# EAGLE design Juki_AD (EAGLE 5.11)

## Sheet 1 of 5
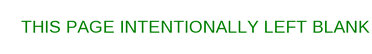
[diagram p0: schematic, sheet 1]

### Notes on the sheet
- THIS PAGE INTENTIONALLY LEFT BLANK

## Sheet 2 of 5
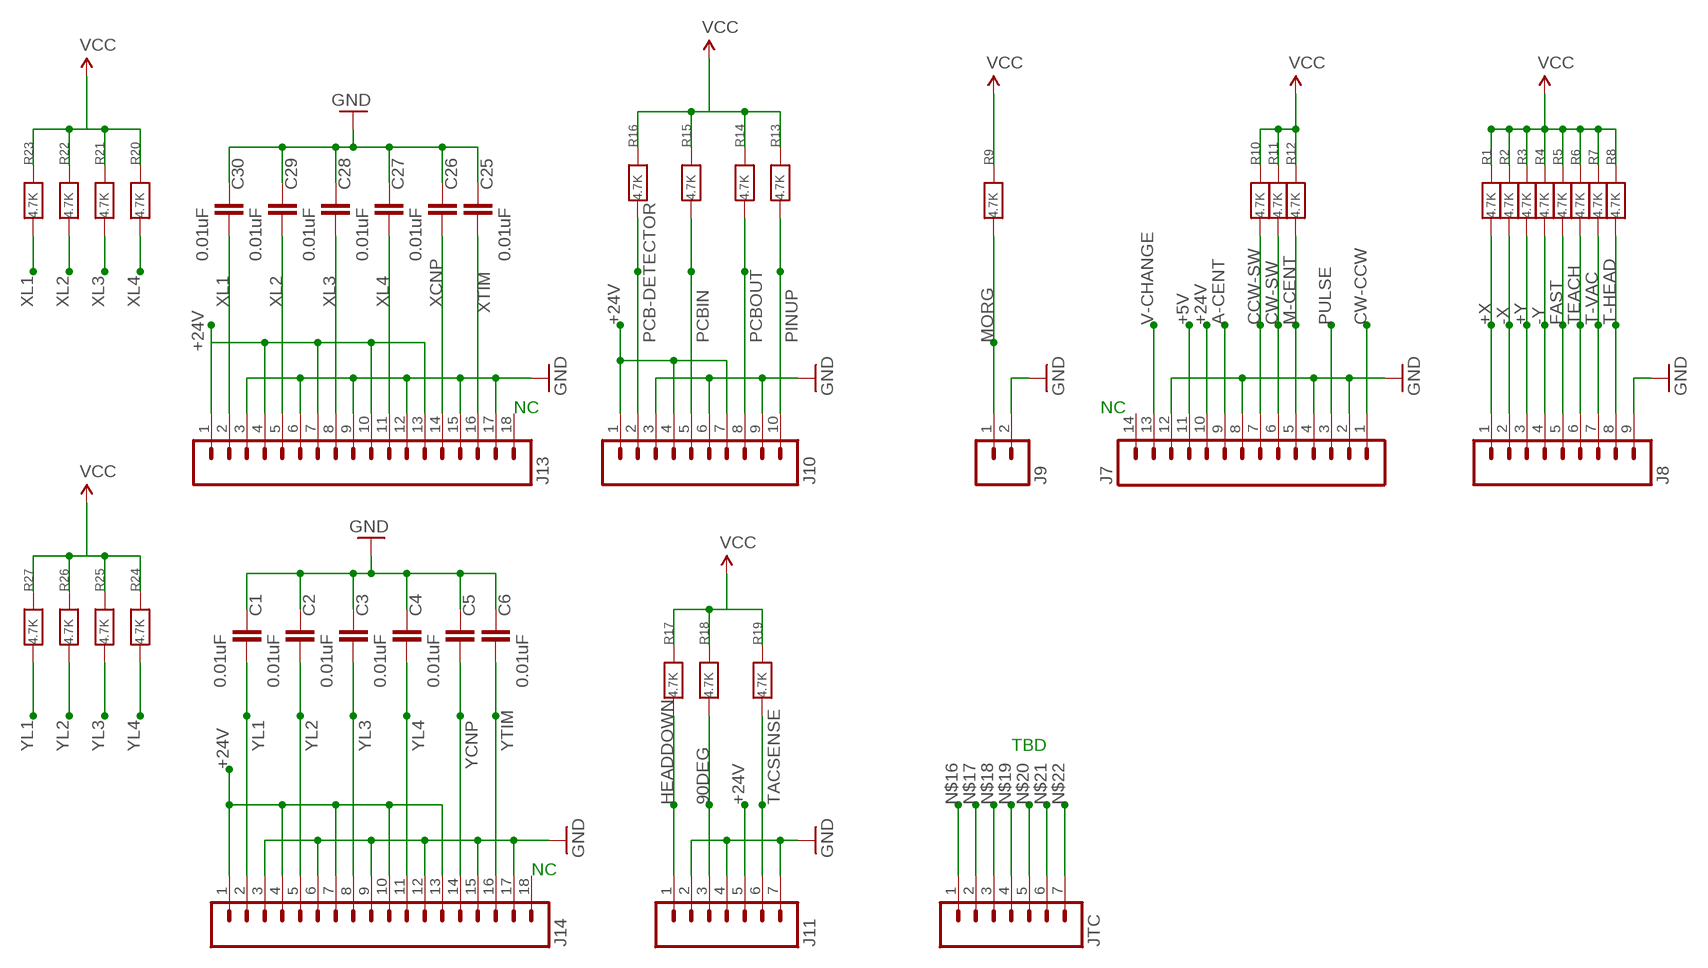
[diagram p1: schematic, sheet 2]

### Parts
C1  0.01uF  CAP0805  [0805]
C2  0.01uF  CAP0805  [0805]
C3  0.01uF  CAP0805  [0805]
C4  0.01uF  CAP0805  [0805]
C5  0.01uF  CAP0805  [0805]
C6  0.01uF  CAP0805  [0805]
C25  0.01uF  CAP0805  [0805]
C26  0.01uF  CAP0805  [0805]
C27  0.01uF  CAP0805  [0805]
C28  0.01uF  CAP0805  [0805]
C29  0.01uF  CAP0805  [0805]
C30  0.01uF  CAP0805  [0805]
J7  M14  [14P]
J8  M09  [09P]
J9  M02  [02P]
J10  M10  [10P]
J11  M07  [07P]
J13  M18  [18P]
J14  M18  [18P]
JTC  M07  [07P]
R1  4.7K  RESISTOR0805  [0805]
R2  4.7K  RESISTOR0805  [0805]
R3  4.7K  RESISTOR0805  [0805]
R4  4.7K  RESISTOR0805  [0805]
R5  4.7K  RESISTOR0805  [0805]
R6  4.7K  RESISTOR0805  [0805]
R7  4.7K  RESISTOR0805  [0805]
R8  4.7K  RESISTOR0805  [0805]
R9  4.7K  RESISTOR0805  [0805]
R10  4.7K  RESISTOR0805  [0805]
R11  4.7K  RESISTOR0805  [0805]
R12  4.7K  RESISTOR0805  [0805]
R13  4.7K  RESISTOR0805  [0805]
R14  4.7K  RESISTOR0805  [0805]
R15  4.7K  RESISTOR0805  [0805]
R16  4.7K  RESISTOR0805  [0805]
R17  4.7K  RESISTOR0805  [0805]
R18  4.7K  RESISTOR0805  [0805]
R19  4.7K  RESISTOR0805  [0805]
R20  4.7K  RESISTOR0805  [0805]
R21  4.7K  RESISTOR0805  [0805]
R22  4.7K  RESISTOR0805  [0805]
R23  4.7K  RESISTOR0805  [0805]
R24  4.7K  RESISTOR0805  [0805]
R25  4.7K  RESISTOR0805  [0805]
R26  4.7K  RESISTOR0805  [0805]
R27  4.7K  RESISTOR0805  [0805]

### Nets
90DEG: J11.3 R18.1
+5V [power]: J7.11 R1.2 R2.2 R3.2 R4.2 R5.2 R6.2 R7.2 R8.2 R9.2 R10.2 R11.2 R12.2 R13.2 R14.2 R15.2 R16.2 R17.2 R18.2 R19.2 R20.2 R21.2 R22.2 R23.2 R24.2 R25.2 R26.2 R27.2 ; supply symbol labelled VCC ; also sheet 3
+24V [power]: J7.10 J10.1 J10.4 J10.7 J11.5 J13.1 J13.4 J13.7 J13.10 J13.13 J14.1 J14.4 J14.7 J14.10 J14.13 ; also sheet 3
+X: J8.1 R1.1
+Y: J8.3 R3.1
-X: J8.2 R2.1
-Y: J8.4 R4.1
A-CENT: J7.9
CCW-SW: J7.7 R10.1
CW-CCW: J7.1
CW-SW: J7.6 R11.1
FAST: J8.5 R5.1
GND: C1.1 C2.1 C3.1 C4.1 C5.1 C6.1 C25.1 C26.1 C27.1 C28.1 C29.1 C30.1 J7.2 J7.4 J7.8 J7.12 J8.9 J9.2 J10.3 J10.6 J10.9 J11.2 J11.4 J11.7 J13.3 J13.6 J13.9 J13.12 J13.15 J13.17 J14.3 J14.6 J14.9 J14.12 J14.15 J14.17 ; also sheet 3,4,5
HEADDOWN: J11.1 R17.1
M-CENT: J7.5 R12.1
MORG: J9.1 R9.1
N$16: JTC.1
N$17: JTC.2
N$18: JTC.3
N$19: JTC.4
N$20: JTC.5
N$21: JTC.6
N$22: JTC.7
PCB-DETECTOR: J10.2 R16.1
PCBIN: J10.5 R15.1
PCBOUT: J10.8 R14.1
PINUP: J10.10 R13.1
PULSE: J7.3
T-HEAD: J8.8 R8.1
T-VAC: J8.7 R7.1
TACSENSE: J11.6 R19.1
TEACH: J8.6 R6.1
V-CHANGE: J7.13
XCNP: C26.2 J13.14
XL1: C30.2 J13.2 R23.1
XL2: C29.2 J13.5 R22.1
XL3: C28.2 J13.8 R21.1
XL4: C27.2 J13.11 R20.1
XTIM: C25.2 J13.16
YCNP: C5.2 J14.14
YL1: C1.2 J14.2 R27.1
YL2: C2.2 J14.5 R26.1
YL3: C3.2 J14.8 R25.1
YL4: C4.2 J14.11 R24.1
YTIM: C6.2 J14.16
Unconnected: J7.14 J13.18 J14.18

### Notes on the sheet
- NC | NC
- TBD
- NC

## Sheet 3 of 5
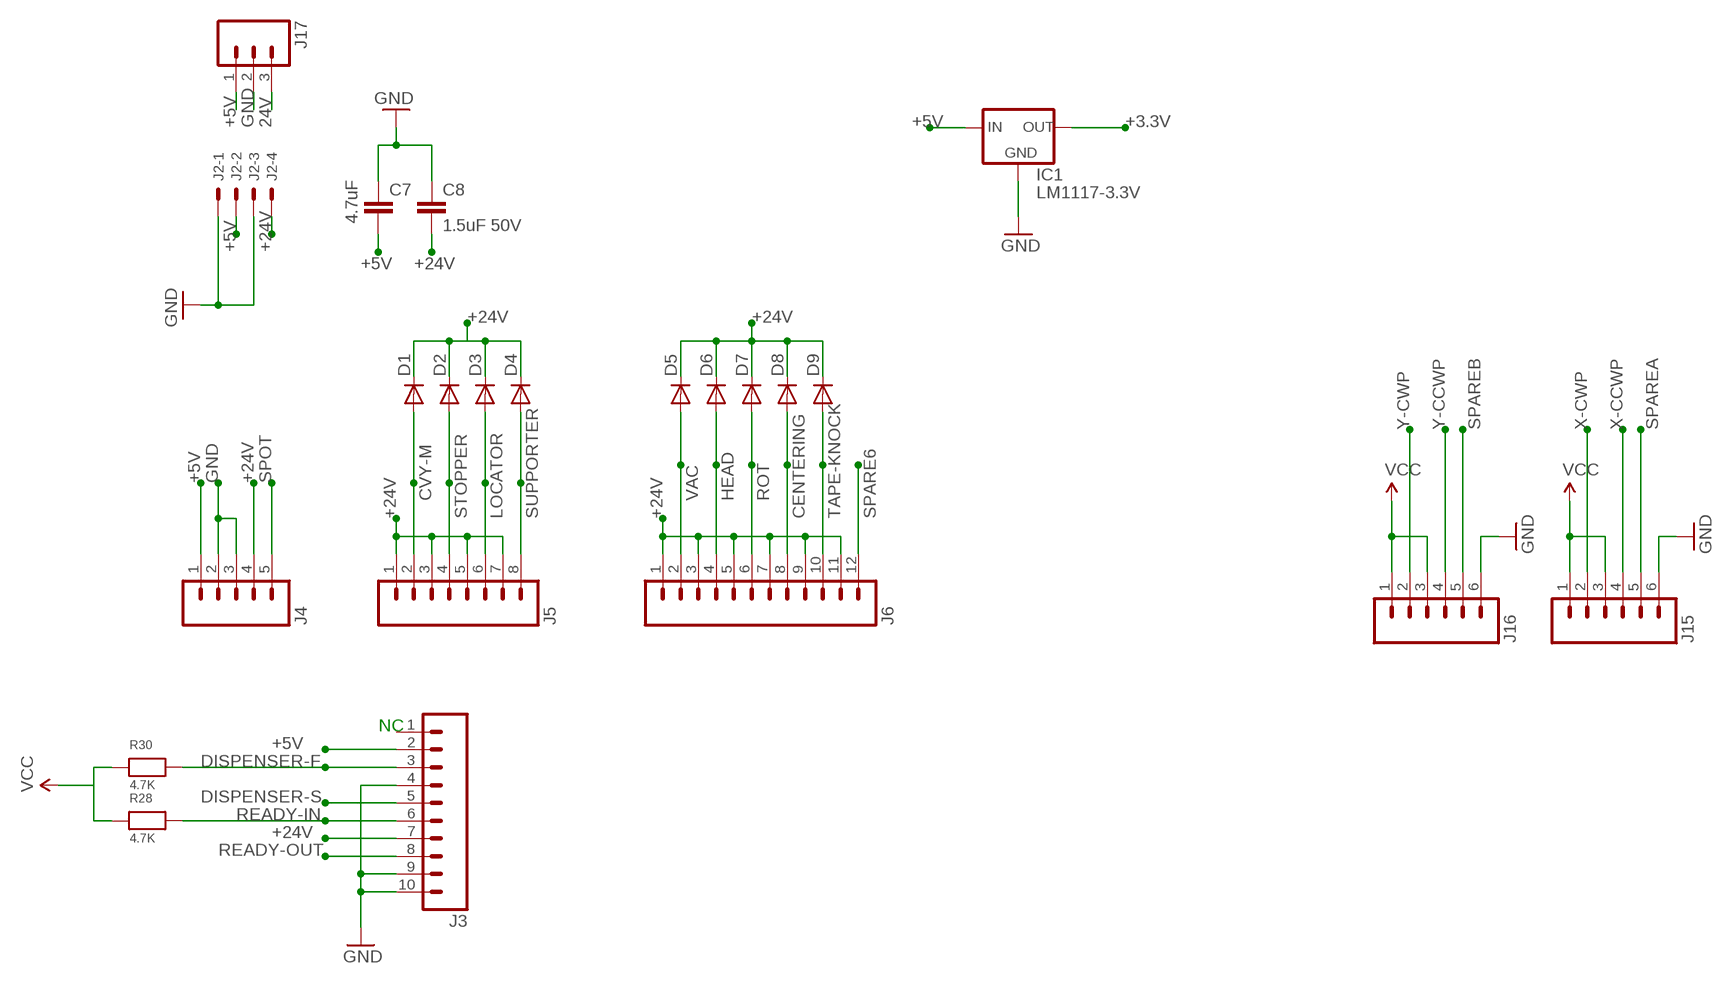
[diagram p2: schematic, sheet 3]

### Parts
C7  4.7uF  CAP0805  [0805]
C8  1.5uF 50V  CAP0805  [0805]
D1  DIODESOD  [SOD-323]
D2  DIODESOD  [SOD-323]
D3  DIODESOD  [SOD-323]
D4  DIODESOD  [SOD-323]
D5  DIODESOD  [SOD-323]
D6  DIODESOD  [SOD-323]
D7  DIODESOD  [SOD-323]
D8  DIODESOD  [SOD-323]
D9  DIODESOD  [SOD-323]
IC1  LM1117-3.3V  LM1117  [SOT223]
J2  KK-156-4  [KK-156-4]
J3  M10  [10P]
J4  M05  [05P]
J5  M08  [08P]
J6  M12  [12P]
J15  M06  [06P]
J16  M06  [06P]
J17  M03  [03P]
R28  4.7K  RESISTOR0805  [0805]
R30  4.7K  RESISTOR0805  [0805]

### Nets
24V: J17.3
+3.3V: IC1.2(OUT)
+5V [power]: C7.2 IC1.3(IN) J2.2 J3.2 J4.1 J15.1 J15.3 J16.1 J16.3 J17.1 R28.1 R30.1 ; supply symbol labelled VCC ; also sheet 2
+24V [power]: C8.2 D1.1(C) D2.1(C) D3.1(C) D4.1(C) D5.1(C) D6.1(C) D7.1(C) D8.1(C) D9.1(C) J2.4 J3.7 J4.4 J5.1 J5.3 J5.5 J5.7 J6.1 J6.3 J6.5 J6.7 J6.9 J6.11 ; also sheet 2
CENTERING: D8.2(A) J6.8 ; also sheet 5
CVY-M: D1.2(A) J5.2
DISPENSER-F: J3.3 R30.2
DISPENSER-S: J3.5
GND: C7.1 C8.1 IC1.1(GND) J2.1 J2.3 J3.4 J3.9 J3.10 J4.2 J4.3 J15.6 J16.6 J17.2 ; also sheet 2,4,5
HEAD: D6.2(A) J6.4 ; also sheet 5
LOCATOR: D3.2(A) J5.6
READY-IN: J3.6 R28.2
READY-OUT: J3.8
ROT: D7.2(A) J6.6 ; also sheet 5
SPARE6: J6.12
SPAREA: J15.5 ; also sheet 5
SPAREB: J16.5 ; also sheet 5
SPOT: J4.5
STOPPER: D2.2(A) J5.4
SUPPORTER: D4.2(A) J5.8
TAPE-KNOCK: D9.2(A) J6.10 ; also sheet 5
VAC: D5.2(A) J6.2 ; also sheet 5
X-CCWP: J15.4 ; also sheet 5
X-CWP: J15.2 ; also sheet 5
Y-CCWP: J16.4 ; also sheet 5
Y-CWP: J16.2 ; also sheet 5
Unconnected: J3.1

### Notes on the sheet
- NC

## Sheet 4 of 5
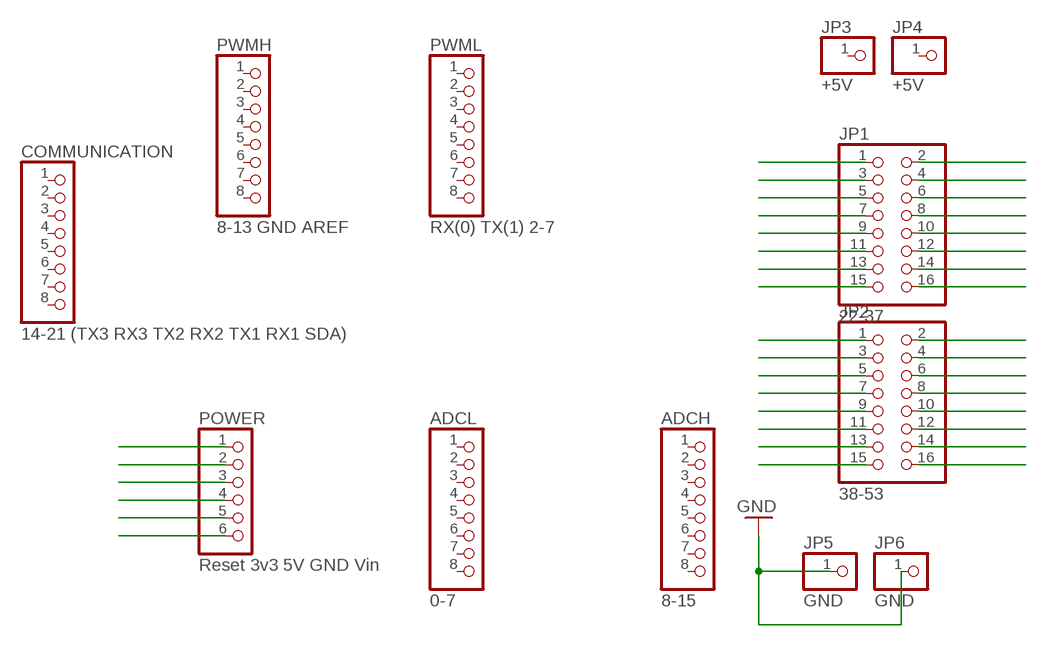
[diagram p3: schematic, sheet 4]

### Parts
ADCH  8-15  PINHD-1X8  [1X08]
ADCL  0-7  PINHD-1X8  [1X08]
COMMUNICATION  14-21 (TX3 RX3 TX2 RX2 TX1 RX1 SDA)  PINHD-1X8  [1X08]
JP1  22-37  PINHD-2X8  [2X08]
JP2  38-53  PINHD-2X8  [2X08]
JP3  +5V  PINHD-1X1  [1X01]
JP4  +5V  PINHD-1X1  [1X01]
JP5  GND  PINHD-1X1  [1X01]
JP6  GND  PINHD-1X1  [1X01]
POWER  Reset 3v3 5V GND Vin  PINHD-1X6  [1X06]
PWMH  8-13 GND AREF  PINHD-1X8  [1X08]
PWML  RX(0) TX(1) 2-7  PINHD-1X8  [1X08]

### Nets
GND: JP5.1 JP6.1 ; also sheet 2,3,5
N$5: JP1.1 JP1.2 JP1.3 JP1.4 JP1.5 JP1.6 JP1.7 JP1.8 JP1.9 JP1.10 JP1.11 JP1.12 JP1.13 JP1.14 JP1.15 JP1.16 JP2.1 JP2.2 JP2.3 JP2.4 JP2.5 JP2.6 JP2.7 JP2.8 JP2.9 JP2.10 JP2.11 JP2.12 JP2.13 JP2.14 JP2.15 JP2.16 POWER.1
N$6: POWER.2
N$7: POWER.3 POWER.4 POWER.5 POWER.6
Unconnected: ADCH.1 ADCH.2 ADCH.3 ADCH.4 ADCH.5 ADCH.6 ADCH.7 ADCH.8 ADCL.1 ADCL.2 ADCL.3 ADCL.4 ADCL.5 ADCL.6 ADCL.7 ADCL.8 COMMUNICATION.1 COMMUNICATION.2 COMMUNICATION.3 COMMUNICATION.4 COMMUNICATION.5 COMMUNICATION.6 COMMUNICATION.7 COMMUNICATION.8 JP3.1 JP4.1 PWMH.1 PWMH.2 PWMH.3 PWMH.4 PWMH.5 PWMH.6 PWMH.7 PWMH.8 PWML.1 PWML.2 PWML.3 PWML.4 PWML.5 PWML.6 PWML.7 PWML.8

## Sheet 5 of 5
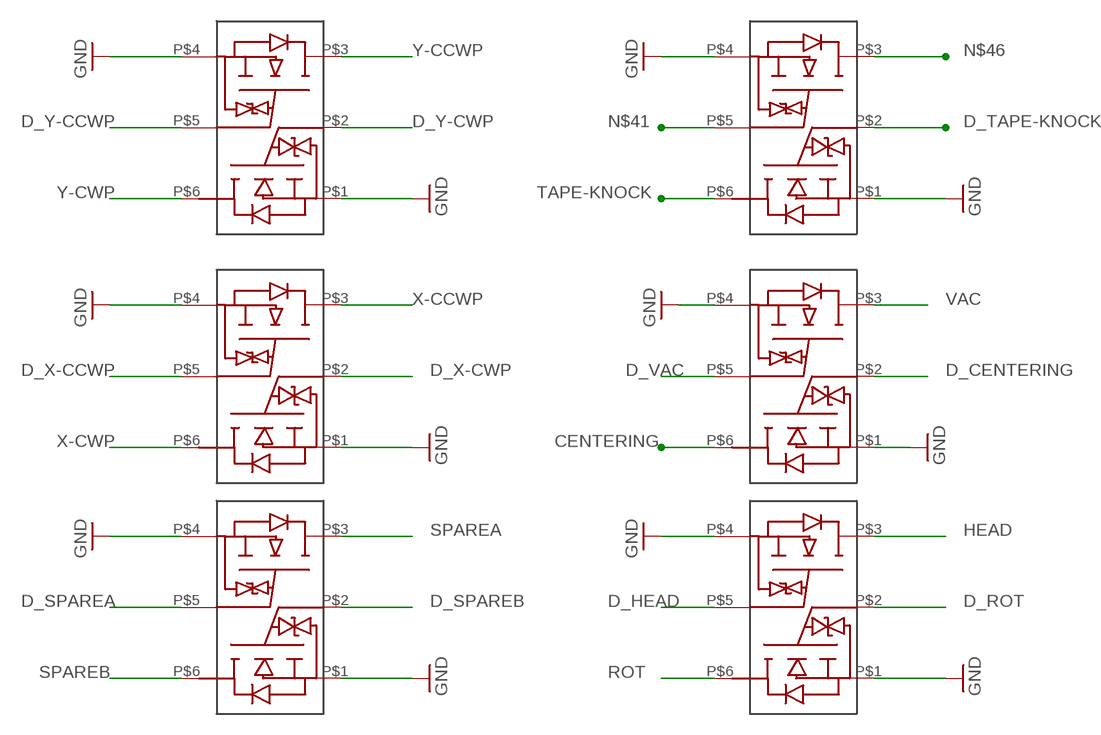
[diagram p4: schematic, sheet 5]

### Parts
U$1  US6K1TR  [TUMT6]
U$2  US6K1TR  [TUMT6]
U$3  US6K1TR  [TUMT6]
U$4  US6K1TR  [TUMT6]
U$5  US6K1TR  [TUMT6]
U$6  US6K1TR  [TUMT6]

### Nets
CENTERING: U$2.P$6 ; also sheet 3
D_CENTERING: U$2.P$2
D_HEAD: U$1.P$5
D_ROT: U$1.P$2
D_SPAREA: U$6.P$5
D_SPAREB: U$6.P$2
D_TAPE-KNOCK: U$4.P$2
D_VAC: U$2.P$5
D_X-CCWP: U$5.P$5
D_X-CWP: U$5.P$2
D_Y-CCWP: U$3.P$5
D_Y-CWP: U$3.P$2
GND: U$1.P$1 U$1.P$4 U$2.P$1 U$2.P$4 U$3.P$1 U$3.P$4 U$4.P$1 U$4.P$4 U$5.P$1 U$5.P$4 U$6.P$1 U$6.P$4 ; also sheet 2,3,4
HEAD: U$1.P$3 ; also sheet 3
N$41: U$4.P$5
N$46: U$4.P$3
ROT: U$1.P$6 ; also sheet 3
SPAREA: U$6.P$3 ; also sheet 3
SPAREB: U$6.P$6 ; also sheet 3
TAPE-KNOCK: U$4.P$6 ; also sheet 3
VAC: U$2.P$3 ; also sheet 3
X-CCWP: U$5.P$3 ; also sheet 3
X-CWP: U$5.P$6 ; also sheet 3
Y-CCWP: U$3.P$3 ; also sheet 3
Y-CWP: U$3.P$6 ; also sheet 3

## Library data of the parts
ADCH ADCL COMMUNICATION PWMH PWML = pinhead:PINHD-1X8: PIN HEADER
C1-C8 C25-C30 = SparkFun:CAP: Capacitor Standard 0603 ceramic capacitor, and 0.1" leaded capacitor.
D1-D9 = SparkFun:DIODE: Diode These are standard reverse protection diodes and small signal diodes. SMA package can handle up to about 1A. SOD-323 can handle about 200mA. What the SOD-323 package when ordering, there are some mfgs out there that are 5-pin packages.
IC1 = v-reg-3:LM1117
J2 = con-molex:KK-156-4: KK 156 HEADER Source: http://www.molex.com/pdm_docs/sd/026604100_sd.pdf; OC_FARNELL: unknown; OC_NEWARK: unknown
J3 J10 = con-amp-quick:M10: AMP QUICK CONNECTOR; OC_FARNELL: unknown; OC_NEWARK: unknown
J4 = con-amp-quick:M05: AMP QUICK CONNECTOR; OC_FARNELL: unknown; OC_NEWARK: unknown
J5 = con-amp-quick:M08: AMP QUICK CONNECTOR; OC_FARNELL: unknown; OC_NEWARK: unknown
J6 = con-amp-quick:M12: AMP QUICK CONNECTOR; OC_FARNELL: unknown; OC_NEWARK: unknown
J7 = con-amp-quick:M14: AMP QUICK CONNECTOR; OC_FARNELL: unknown; OC_NEWARK: unknown
J8 = con-amp-quick:M09: AMP QUICK CONNECTOR; OC_FARNELL: unknown; OC_NEWARK: unknown
J9 = con-amp-quick:M02: AMP QUICK CONNECTOR; OC_FARNELL: unknown; OC_NEWARK: unknown
J11 JTC = con-amp-quick:M07: AMP QUICK CONNECTOR; OC_FARNELL: unknown; OC_NEWARK: unknown
J13 J14 = con-amp-quick:M18: M18P Header
J15 J16 = con-amp-quick:M06: AMP QUICK CONNECTOR; OC_FARNELL: unknown; OC_NEWARK: unknown
J17 = con-amp-quick:M03: AMP QUICK CONNECTOR; OC_FARNELL: unknown; OC_NEWARK: unknown
JP1 JP2 = pinhead:PINHD-2X8: PIN HEADER
JP3-JP6 = pinhead:PINHD-1X1: PIN HEADER
POWER = pinhead:PINHD-1X6: PIN HEADER
R1-R28 R30 = microbuilder:RESISTOR: Resistors 0402 - 0402 Surface Mount Package 10.0K 1% 1/16W [Digikey: 311-10.0KLRTR-ND] 0603 - 0603 Surface Mount Package 0 Ohm 1/10 Watt 1% Resistor 15 Ohm 1/10 Watt 1% Resistor 33 Ohm 1/10 Watt 1% Resistor 49.9 Ohm 1/10 Watt 1% Resistor 100 Ohm 1/10 Watt 1% Resistor 150 Ohm 1/10 Watt 1% Resistor 240 Ohm 1/10 Watt 1% Resistor 390 Ohm 1/10 Watt 1% Resistor 560 Ohm 1/10 Watt 1% Resistor 750 Ohm 1/10 Watt 1% Resistor 1.0K Ohm 1/10 Watt 1% Resistor 1.5K Ohm 1/10 Watt 1% Resistor 2.0K Ohm 1/10 Watt 1% Resistor 4.7K Ohm 1/10 Watt 1% Resistor 10.0K Ohm 1/10 Watt 1% Resistor 20.0K Ohm 1/10 Watt 1% Resistor 33.0K Ohm 1/10 Watt 1% Resistor 100.0K Ohm 1/10 Watt 1% Resistor 0805 - 0805 Surface Mount Package 0 Ohm 1/8 Watt 1% Resistor 33 Ohm 1/8 Watt 1% Resistor 100 Ohm 1/8 Watt 1% Resistor 150 Ohm 1/8 Watt 1% Resistor 200 Ohm 1/8 Watt 1% Resistor 240 Ohm 1/8 Watt 1% Resistor 330 Ohm 1/8 Watt 1% Resistor 390 Ohm 1/8 Watt 1% Resistor 470 Ohm 1/8 Watt 1% Resistor 1.0K Ohm 1/8 Watt 1% Resistor 1.5K Ohm 1/8 Watt 1% Resistor 2.0K Ohm 1/8 Watt 1% Resistor 4.7K Ohm 1/8 Watt 1% Resistor 5.1K Ohm 1/8 Watt 1% Resistor 5.6K Ohm 1/8 Watt 1% Resistor 10.0K Ohm 1/8 Watt 1% Resistor 22.0K Ohm 1/8 Watt 1% Resistor 33.0K Ohm 1/8 Watt 1% Resistor 100K Ohm 1/8 Watt 1% Resistor 1206 - 1206 Surface Mount Package
U$1-U$6 = Nullspace:US6K1TR: US6K1TR MOSFET

## Net classes
0 default: width 0.254 mm
1 power: width 0.635 mm

## Board
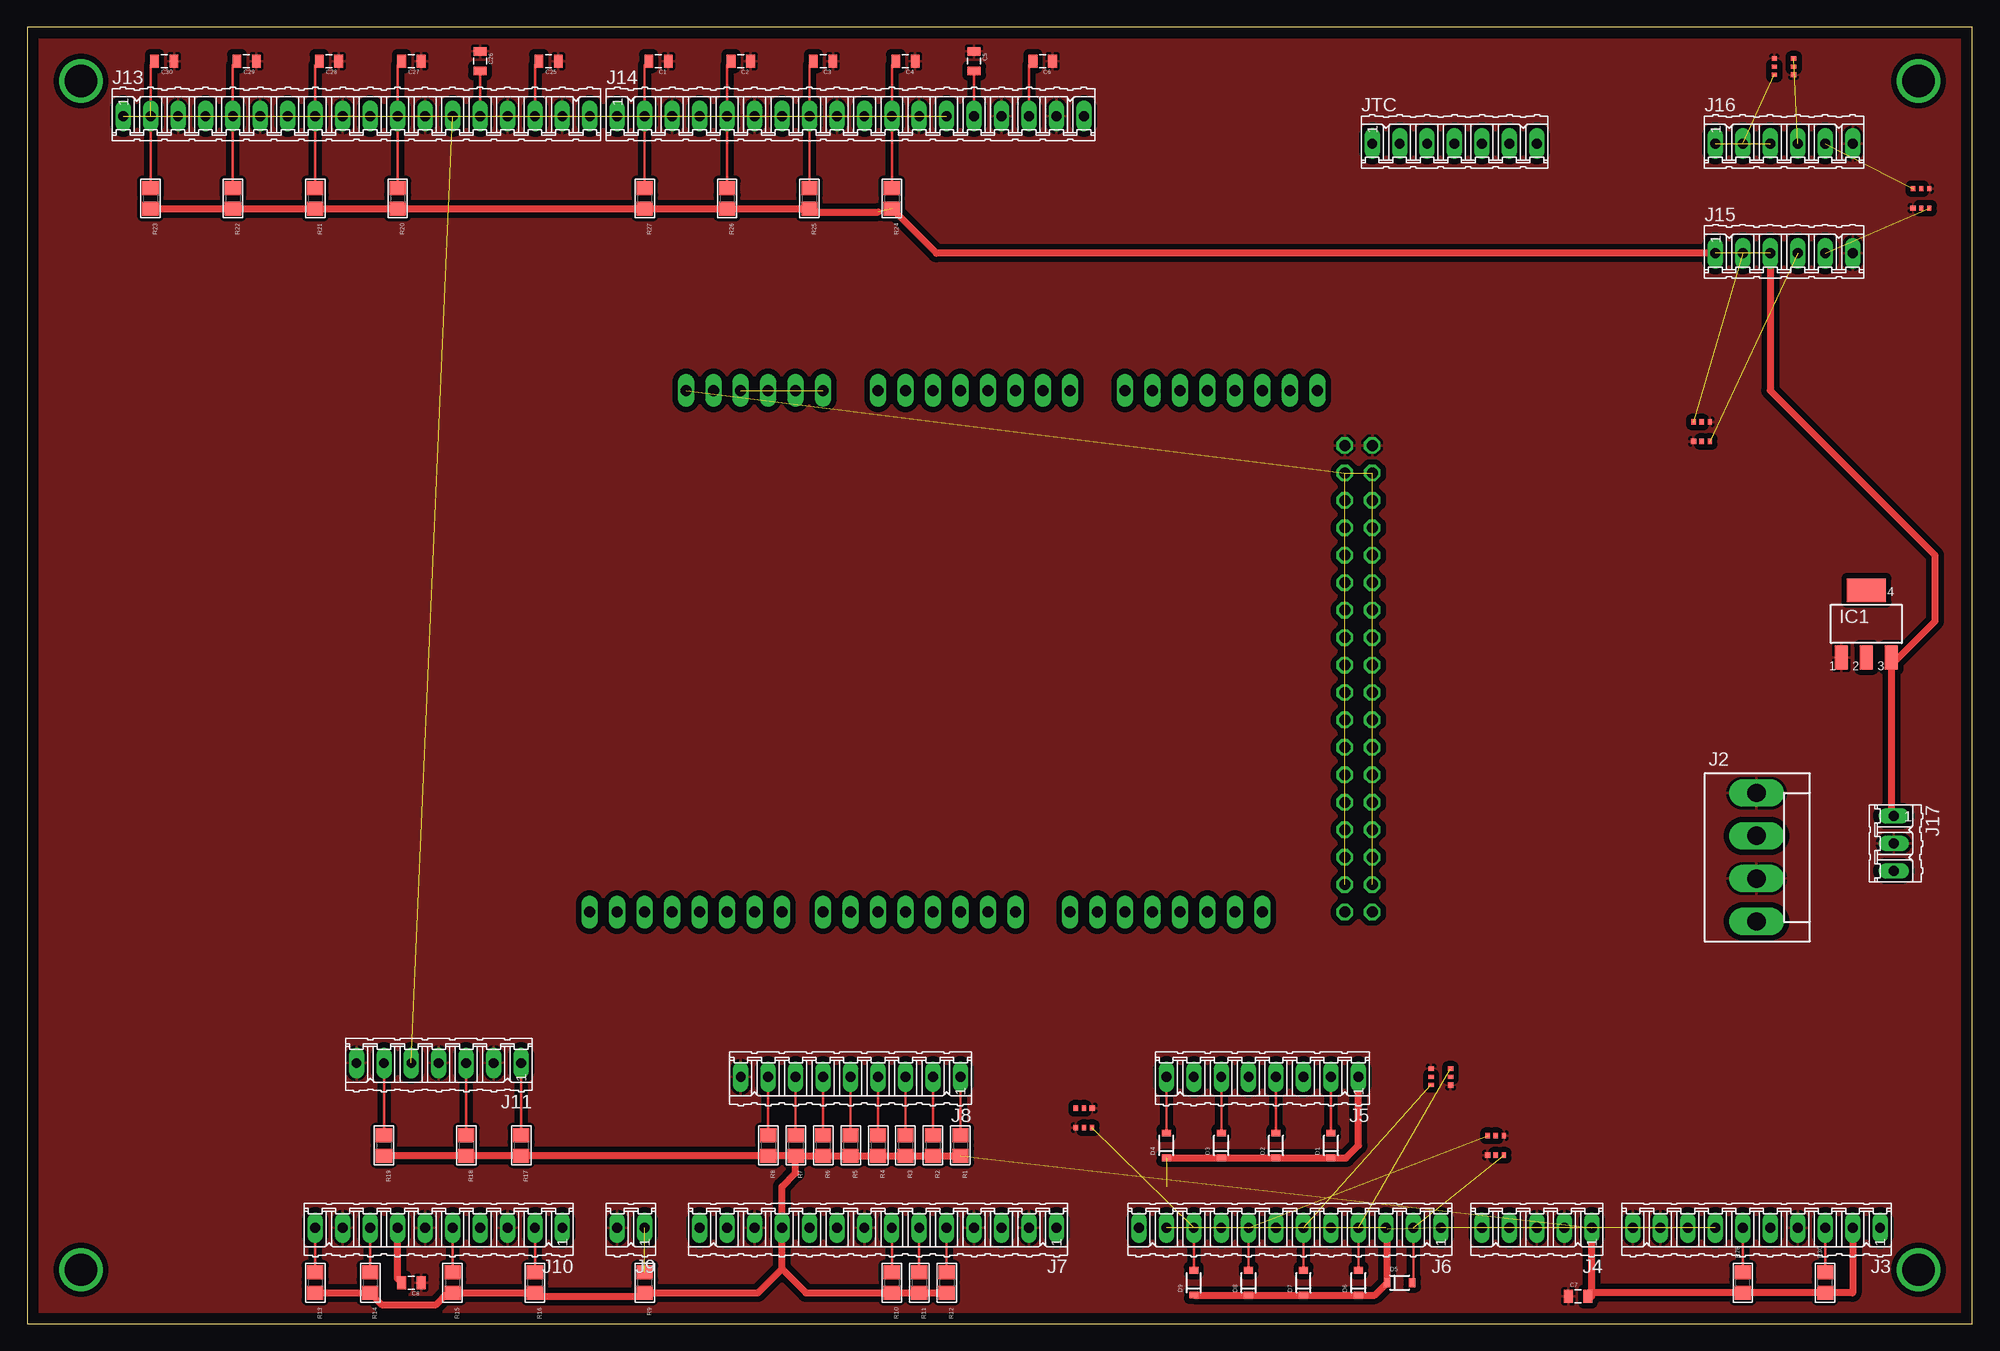
[diagram p5: board, top side]
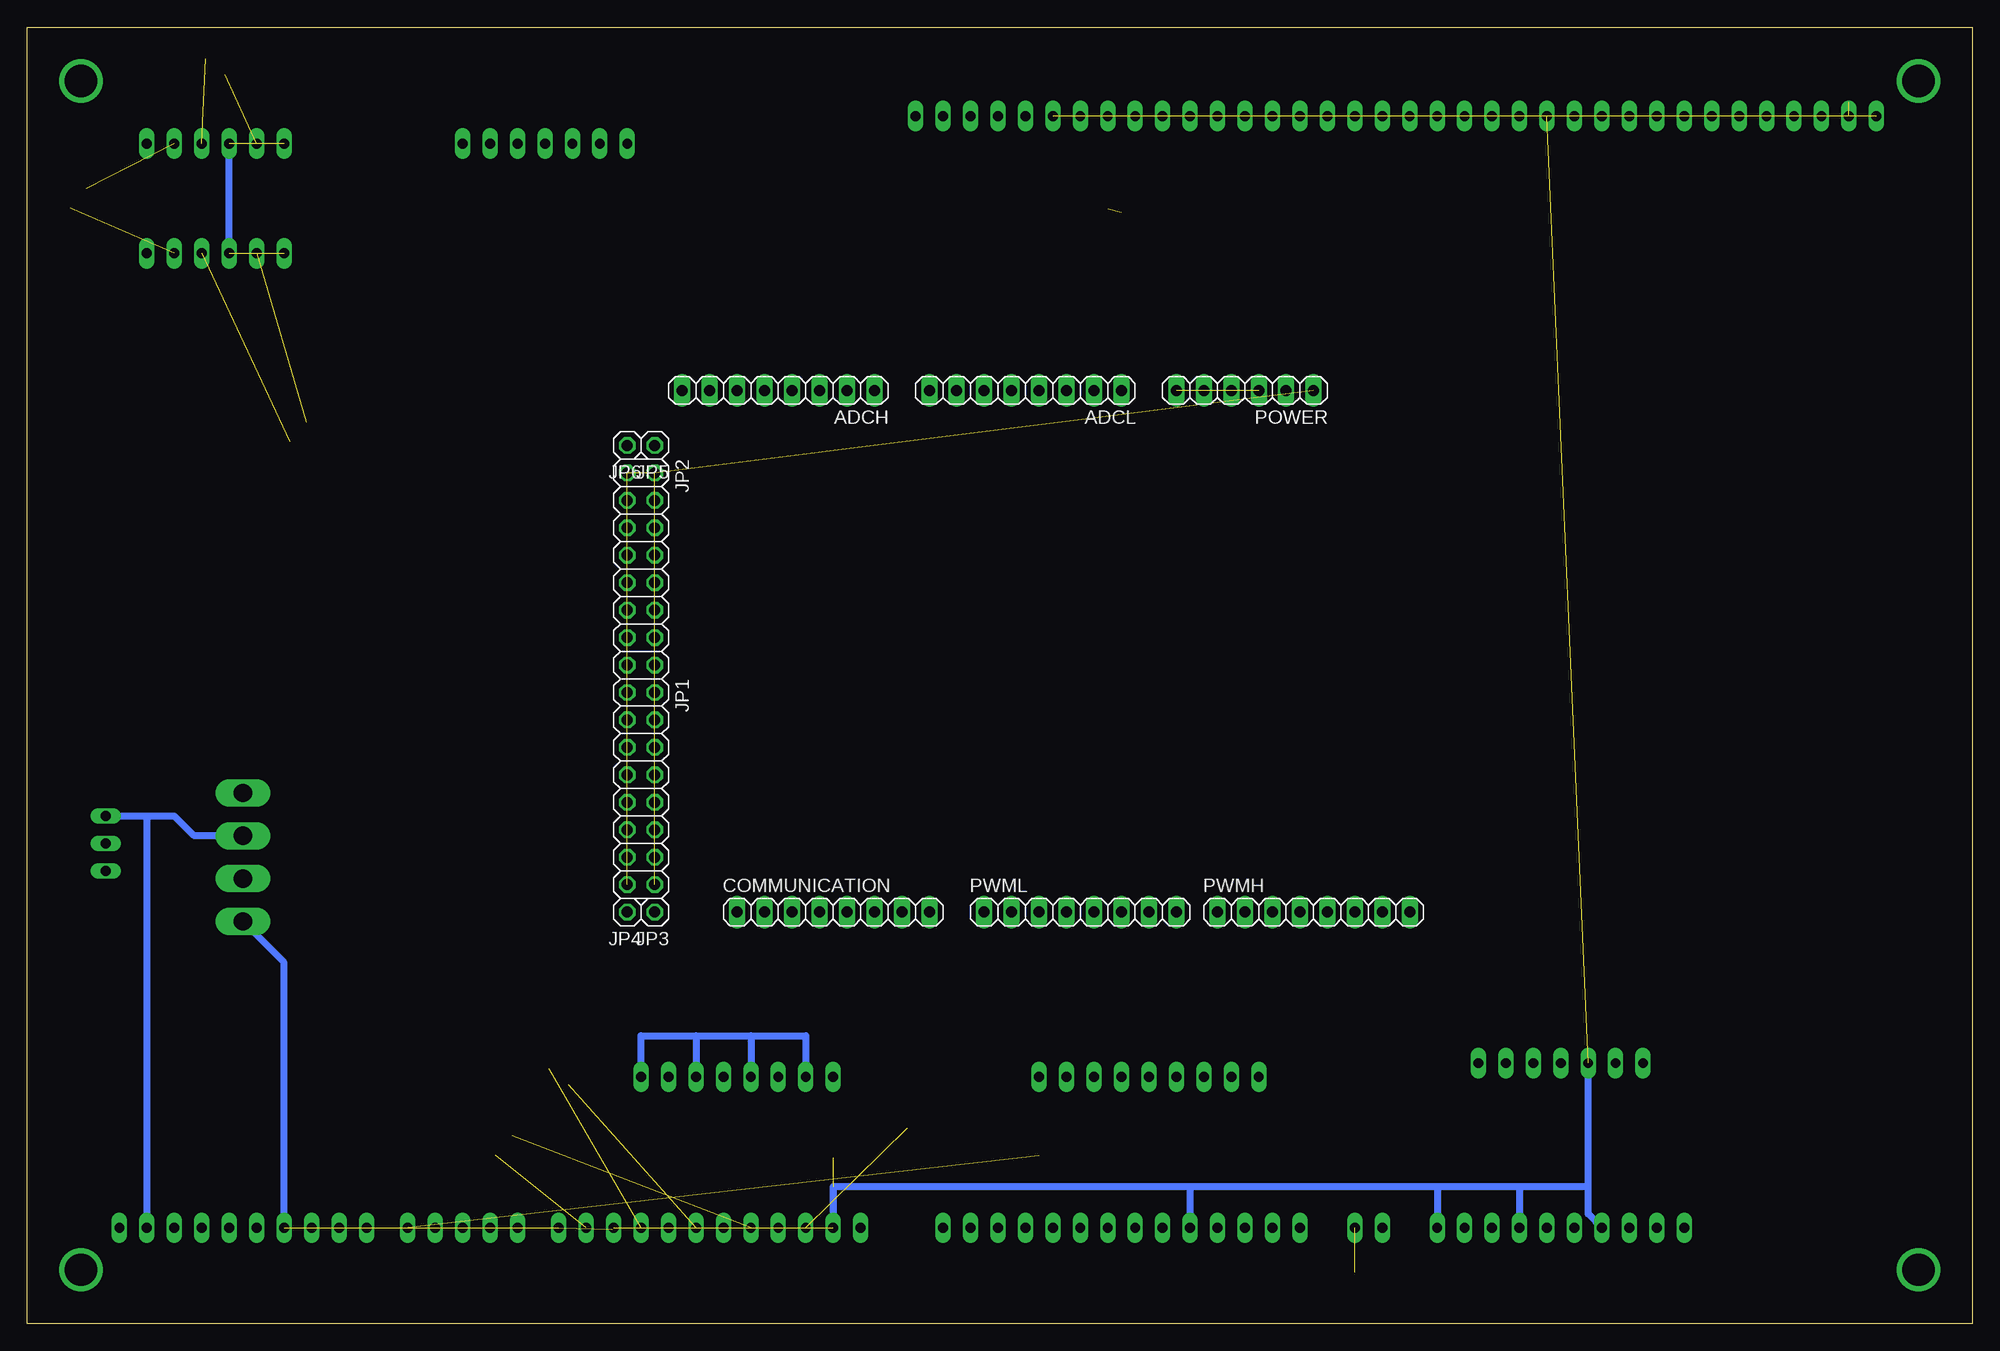
[diagram p6: board, bottom side, seen from below]

Size 180 x 120 mm. Coordinates in mm from the lower left corner, seen from the top.
Outline: 0,0 180,0 180,120 0,120 0,0
Copper layers (1*16): Top 0.035mm / dielectric 1.5mm / Bottom 0.035mm
Design rules "default": minimum track width 10mil, minimum drill 24mil, track to track 8mil, track to pad 8mil, pad to pad 8mil, via to via 8mil, smd to smd 8mil, copper to edge 40mil, drill to drill 8mil, minimum pad ring 10mil, minimum via ring 8mil, stop-mask expansion 4mil, vias tented up to drill 0mil, thermal gap 10mil

### Footprints (pad centres in the part's own frame; a part is rotated, then mirrored left to right if it is on the bottom)
1X08 = drill 1.016 long: 1 -8.89,0; 2 -6.35,0; 3 -3.81,0; 4 -1.27,0; 5 1.27,0; 6 3.81,0; 7 6.35,0; 8 8.89,0
0805 = smd 0.8 x 1.2: 1 -0.9,0; 2 0.9,0
SOD-323 = smd 0.63 x 0.83: 1 -1.15,0; 2 1.15,0
SOT223 = smd 1.219 x 2.235: 1 -2.311,-3.099; 2 0,-3.099; 3 2.311,-3.099 | smd 3.6 x 2.2: 4 0,3.099
KK-156-4 = drill 1.7 pad 2.184 long: 1 -5.94,0; 2 -1.98,0; 3 1.98,0; 4 5.94,0
10P = drill 0.914 long: 1 -11.43,0; 2 -8.89,0; 3 -6.35,0; 4 -3.81,0; 5 -1.27,0; 6 1.27,0; 7 3.81,0; 8 6.35,0; 9 8.89,0; 10 11.43,0
05P = drill 0.914 long: 1 -5.08,0; 2 -2.54,0; 3 0,0; 4 2.54,0; 5 5.08,0
08P = drill 0.914 long: 1 -8.89,0; 2 -6.35,0; 3 -3.81,0; 4 -1.27,0; 5 1.27,0; 6 3.81,0; 7 6.35,0; 8 8.89,0
12P = drill 0.914 long: 1 -13.97,0; 2 -11.43,0; 3 -8.89,0; 4 -6.35,0; 5 -3.81,0; 6 -1.27,0; 7 1.27,0; 8 3.81,0; 9 6.35,0; 10 8.89,0; 11 11.43,0; 12 13.97,0
14P = drill 0.914 long: 1 -16.51,0; 2 -13.97,0; 3 -11.43,0; 4 -8.89,0; 5 -6.35,0; 6 -3.81,0; 7 -1.27,0; 8 1.27,0; 9 3.81,0; 10 6.35,0; 11 8.89,0; 12 11.43,0; 13 13.97,0; 14 16.51,0
09P = drill 0.914 long: 1 -10.16,0; 2 -7.62,0; 3 -5.08,0; 4 -2.54,0; 5 0,0; 6 2.54,0; 7 5.08,0; 8 7.62,0; 9 10.16,0
02P = drill 0.914 long: 1 -1.27,0; 2 1.27,0
07P = drill 0.914 long: 1 -7.62,0; 2 -5.08,0; 3 -2.54,0; 4 0,0; 5 2.54,0; 6 5.08,0; 7 7.62,0
18P = drill 0.914 long: 1 -21.59,0; 2 -19.05,0; 3 -16.51,0; 4 -13.97,0; 5 -11.43,0; 6 -8.89,0; 7 -6.35,0; 8 -3.81,0; 9 -1.27,0; 10 1.27,0; 11 3.81,0; 12 6.35,0; 13 8.89,0; 14 11.43,0; 15 13.97,0; 16 16.51,0; 17 19.05,0; 18 21.59,0
06P = drill 0.914 long: 1 -6.35,0; 2 -3.81,0; 3 -1.27,0; 4 1.27,0; 5 3.81,0; 6 6.35,0
03P = drill 0.914 long: 1 -2.54,0; 2 0,0; 3 2.54,0
2X08 = drill 1.016 octagon: 1 -8.89,-1.27; 2 -8.89,1.27; 3 -6.35,-1.27; 4 -6.35,1.27; 5 -3.81,-1.27; 6 -3.81,1.27; 7 -1.27,-1.27; 8 -1.27,1.27; 9 1.27,-1.27; 10 1.27,1.27; 11 3.81,-1.27; 12 3.81,1.27; 13 6.35,-1.27; 14 6.35,1.27; 15 8.89,-1.27; 16 8.89,1.27
1X01 = drill 1.016 octagon: 1 0,0
1X06 = drill 1.016 long: 1 -6.35,0; 2 -3.81,0; 3 -1.27,0; 4 1.27,0; 5 3.81,0; 6 6.35,0
0805' = smd 1.3 x 1.5: 1 -0.95,0; 2 0.95,0
TUMT6 = smd 0.5 x 0.5: P$1 -0.75,-0.9 | smd 0.4 x 0.5: P$2 0,-0.9; P$3 0.75,-0.9; P$4 0.75,0.9; P$5 0,0.9; P$6 -0.75,0.9

### Placement (x,y rotation side)
ADCH  110.49,86.36 180 bottom
ADCL  87.63,86.36 180 bottom
C1  58.42,116.84 180 top
C2  66.04,116.84 180 top
C3  73.66,116.84 180 top
C4  81.28,116.84 180 top
C5  87.63,116.84 270 top
C6  93.98,116.84 180 top
C7  143.51,2.54 0 top
C8  35.56,3.81 180 top
C25  48.26,116.84 180 top
C26  41.91,116.84 270 top
C27  35.56,116.84 180 top
C28  27.94,116.84 180 top
C29  20.32,116.84 180 top
C30  12.7,116.84 180 top
COMMUNICATION  105.41,38.1 0 bottom
D1  120.65,16.51 90 top
D2  115.57,16.51 90 top
D3  110.49,16.51 90 top
D4  105.41,16.51 90 top
D5  127,3.81 0 top
D6  123.19,3.81 90 top
D7  118.11,3.81 90 top
D8  113.03,3.81 90 top
D9  107.95,3.81 90 top
IC1  170.18,64.77 0 top
J2  160.02,43.18 270 top
J3  160.02,8.89 180 top
J4  139.7,8.89 180 top
J5  114.3,22.86 180 top
J6  116.84,8.89 180 top
J7  78.74,8.89 180 top
J8  76.2,22.86 180 top
J9  55.88,8.89 180 top
J10  38.1,8.89 180 top
J11  38.1,24.13 180 top
J13  30.48,111.76 0 top
J14  76.2,111.76 0 top
J15  162.56,99.06 0 top
J16  162.56,109.22 0 top
J17  172.72,44.45 270 top
JP1  123.19,49.53 270 bottom
JP2  123.19,69.85 270 bottom
JP3  121.92,38.1 180 bottom
JP4  124.46,38.1 180 bottom
JP5  121.92,81.28 180 bottom
JP6  124.46,81.28 180 bottom
JTC  132.08,109.22 0 top
POWER  67.31,86.36 180 bottom
PWMH  60.96,38.1 0 bottom
PWML  82.55,38.1 0 bottom
R1  4.7K  [0805']  86.36,16.51 270 top
R2  4.7K  [0805']  83.82,16.51 270 top
R3  4.7K  [0805']  81.28,16.51 270 top
R4  4.7K  [0805']  78.74,16.51 270 top
R5  4.7K  [0805']  76.2,16.51 270 top
R6  4.7K  [0805']  73.66,16.51 270 top
R7  4.7K  [0805']  71.12,16.51 270 top
R8  4.7K  [0805']  68.58,16.51 270 top
R9  4.7K  [0805']  57.15,3.81 270 top
R10  4.7K  [0805']  80.01,3.81 270 top
R11  4.7K  [0805']  82.55,3.81 270 top
R12  4.7K  [0805']  85.09,3.81 270 top
R13  4.7K  [0805']  26.67,3.81 270 top
R14  4.7K  [0805']  31.75,3.81 270 top
R15  4.7K  [0805']  39.37,3.81 270 top
R16  4.7K  [0805']  46.99,3.81 270 top
R17  4.7K  [0805']  45.72,16.51 270 top
R18  4.7K  [0805']  40.64,16.51 270 top
R19  4.7K  [0805']  33.02,16.51 270 top
R20  4.7K  [0805']  34.29,104.14 270 top
R21  4.7K  [0805']  26.67,104.14 270 top
R22  4.7K  [0805']  19.05,104.14 270 top
R23  4.7K  [0805']  11.43,104.14 270 top
R24  4.7K  [0805']  80.01,104.14 270 top
R25  4.7K  [0805']  72.39,104.14 270 top
R26  4.7K  [0805']  64.77,104.14 270 top
R27  4.7K  [0805']  57.15,104.14 270 top
R28  4.7K  [0805']  158.75,3.81 90 top
R30  4.7K  [0805']  166.37,3.81 90 top
U$1  130.81,22.86 90 top
U$2  135.89,16.51 0 top
U$3  162.56,116.33 90 top
U$4  97.79,19.05 180 top
U$5  154.94,82.55 0 top
U$6  175.26,104.14 0 top

### Tracks (layer width: path | path; a pad name or v marks a point on that pad's centre or on a via)
90DEG
  Top 0.254: R18.1 J11.3
+5V  (via drill 0.61)  (4 unrouted)
  Top 0.635: R23.2 R22.2 R21.2 R20.2 R27.2 R26.2 R25.2 72.71,102.87 78.74,102.87 | R7.2 71.12,13.97 69.85,12.7 J7.11 69.85,5.08 | R7.2 R8.2 R17.2 R18.2 R19.2 | R7.2 R6.2 R5.2 R4.2 R3.2 R2.2 R1.2 | 172.49,60.96 172.49,46.99 J17.1 | 172.49,60.96 IC1.3 | v160.07,45.21 J2.2 | J15.3 161.29,86.36 176.53,71.12 176.53,65 172.49,60.96 | J3.2 168.91,2.86 R30.1 R28.1 144.41,2.86 C7.2 144.78,2.54 J4.1 | R12.2 R11.2 R10.2 72.07,2.86 69.85,5.08 | R13.2 R14.2 32.83,1.78 37.85,1.78 38.93,2.86 R15.2 R16.2 46.99,2.54 56.83,2.54 R9.2 67.63,2.86 69.85,5.08 | R24.2 84.14,99.06 J15.1
  Bottom 0.635: J15.3 J16.3 | J17.1 168.91,46.99 | v160.07,45.21 164.59,45.21 166.37,46.99 168.91,46.99 | 168.91,46.99 J3.2
+24V  (18 unrouted)
  Top 0.635: D4.1 D3.1 D2.1 D1.1 122.04,15.36 123.19,16.51 J5.1 | J6.3 125.85,8.77 D5.1 124.7,2.66 D6.1 D7.1 D8.1 D9.1 | C8.2 34.29,4.18 J10.7
  Bottom 0.635: J5.7 107.95,26.67 113.03,26.67 | 113.03,26.67 J5.5 | 118.11,26.67 J5.3 | 118.11,26.67 113.03,26.67 | J5.1 123.19,26.67 118.11,26.67 | J2.4 156.21,33.43 J3.7 | J10.7 35.56,10.16 35.56,12.7 | 35.56,12.7 J11.5 | 41.91,12.7 49.53,12.7 | 41.91,12.7 J10.4 | 35.56,12.7 41.91,12.7 | 49.53,12.7 J10.1 | 49.53,12.7 72.39,12.7 | 72.39,12.7 J7.10 | 72.39,12.7 105.41,12.7 J6.11
+X
  Top 0.254: R1.1 J8.1
+Y
  Top 0.254: R3.1 J8.3
-X
  Top 0.254: R2.1 J8.2
-Y
  Top 0.254: R4.1 J8.4
CCW-SW
  Top 0.254: R10.1 J7.7
CENTERING  (1 unrouted)
  Top 0.254: D8.2 J6.8
CVY-M
  Top 0.254: D1.2 J5.2
CW-SW
  Top 0.254: R11.1 J7.6
DISPENSER-F
  Top 0.254: R30.2 J3.3
FAST
  Top 0.254: R5.1 J8.5
GND
  pour Top (isolate 0.508): 180.34,119.38 0,119.38 0,0 180.34,0
HEAD  (1 unrouted)
  Top 0.254: D6.2 J6.4
HEADDOWN
  Top 0.254: R17.1 J11.1
LOCATOR
  Top 0.254: D3.2 J5.6
M-CENT
  Top 0.254: R12.1 J7.5
MORG  (1 unrouted)
N$1  (via drill 3)
  other vias: 175,5
N$2  (via drill 3)
  other vias: 5,5
N$3  (via drill 3)
  other vias: 5,115
N$4  (via drill 3)
  other vias: 175,115
N$5  (32 unrouted)
N$7  (3 unrouted)
PCB-DETECTOR
  Top 0.254: R16.1 J10.2
PCBIN
  Top 0.254: R15.1 J10.5
PCBOUT
  Top 0.254: R14.1 J10.8
PINUP
  Top 0.254: R13.1 J10.10
READY-IN
  Top 0.254: R28.2 J3.6
ROT  (1 unrouted)
  Top 0.254: D7.2 J6.6
SPAREA  (1 unrouted)
SPAREB  (1 unrouted)
STOPPER
  Top 0.254: D2.2 J5.4
SUPPORTER
  Top 0.254: D4.2 J5.8
T-HEAD
  Top 0.254: R8.1 J8.8
T-VAC
  Top 0.254: R7.1 J8.7
TACSENSE
  Top 0.254: R19.1 J11.6
TAPE-KNOCK  (1 unrouted)
  Top 0.254: D9.2 J6.10
TEACH
  Top 0.254: R6.1 J8.6
VAC  (1 unrouted)
  Top 0.254: J6.2 128.27,3.93 D5.2
X-CCWP  (1 unrouted)
X-CWP  (1 unrouted)
XCNP
  Top 0.254: J13.14 C26.2
XL1  (1 unrouted)
  Top 0.254: C30.2 11.43,116.47 11.43,113.03 | R23.1 J13.2
XL2
  Top 0.254: C29.2 19.05,116.47 J13.5 R22.1
XL3
  Top 0.254: C28.2 26.67,116.47 J13.8 R21.1
XL4
  Top 0.254: C27.2 34.29,116.47 J13.11 R20.1
XTIM
  Top 0.254: J13.16 46.99,116.47 C25.2
Y-CCWP  (1 unrouted)
Y-CWP  (1 unrouted)
YCNP
  Top 0.254: J14.14 C5.2
YL1
  Top 0.254: C1.2 57.15,116.47 J14.2 R27.1
YL2
  Top 0.254: R26.1 J14.5 64.77,116.47 C2.2
YL3
  Top 0.254: R25.1 J14.8 72.39,116.47 C3.2
YL4
  Top 0.254: R24.1 J14.11 80.01,116.47 C4.2
YTIM
  Top 0.254: C6.2 92.71,116.47 J14.16